# Altium schematic sheet fpga.SchDoc: Copper Suicide - FPGA
size Letter; CheckedBy: E. Chiu; CompanyName: Signal Laboratories, Inc.; DrawnBy: J. Brinton; Engineer: J. Brinton; Address1: 3479 Edison Way; Address2: Menlo Park CA 94025; Address3: +1 (877) 778-8435; Address4: siglabs.com; Revision: 1; SheetNumber: 4; SheetTotal: 44
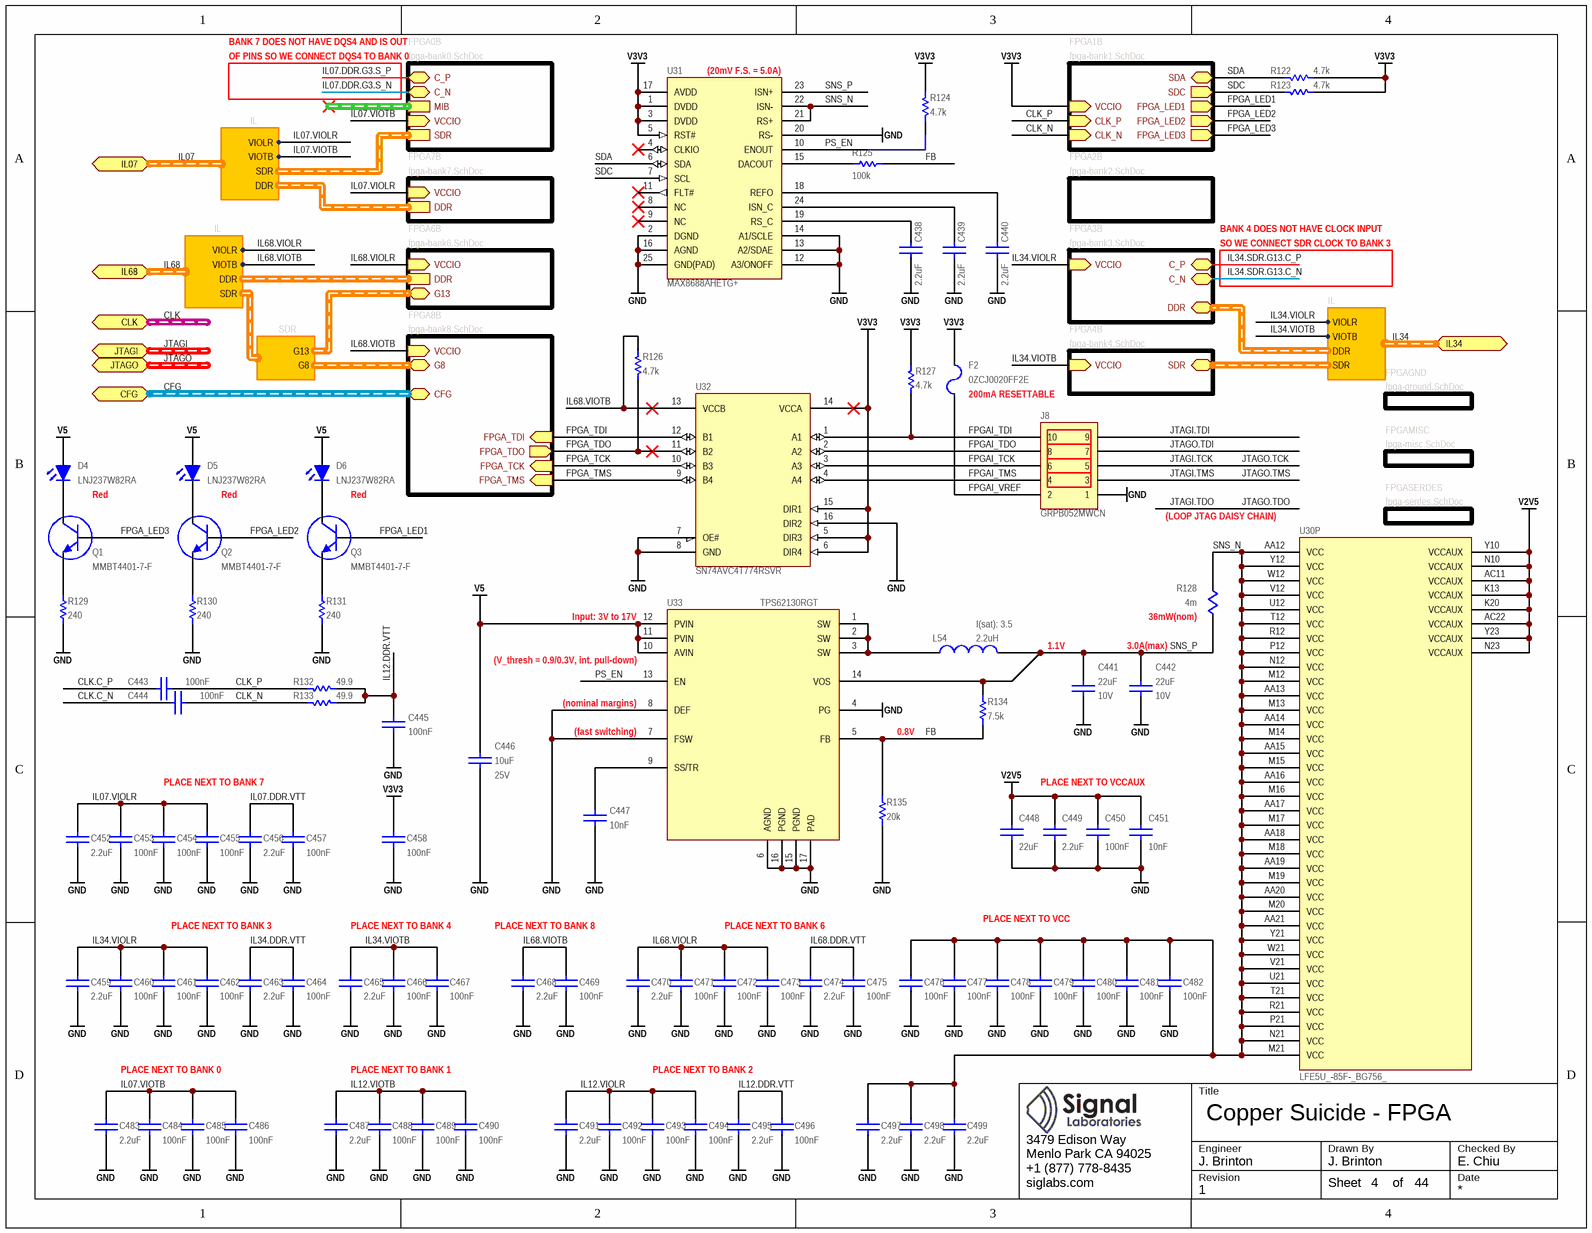
[diagram p0: fpga.SchDoc]

## Parts
C438  value 2.2uF  [CAPC160X80X90L20N]  (hidden comment: C1608X7R1A225M080)
C439  value 2.2uF  [CAPC160X80X90L20N]  (hidden comment: C1608X7R1A225M080)
C440  value 2.2uF  [CAPC160X80X90L20N]  (hidden comment: C1608X7R1A225M080)
C441  value 22uF  Voltage: 10V  [CAPC200X125X145L45N]  (hidden comment: C2012X7S1A226M125)
C442  value 22uF  Voltage: 10V  [CAPC200X125X145L45N]  (hidden comment: C2012X7S1A226M125)
C443  value 100nF  [CAPC100X50X55L25N]  (hidden comment: GCM155R71H104KE02)
C444  value 100nF  [CAPC100X50X55L25N]  (hidden comment: GCM155R71H104KE02)
C445  value 100nF  [CAPC100X50X55L25N]  (hidden comment: GCM155R71H104KE02)
C446  value 10uF  Voltage: 25V  [CAPC200X125X145L45N]  (hidden comment: GRM21BC81E106KE51)
C447  value 10nF  [CAPC100X50X55L25N]  (hidden comment: GRM155R71H103KA88)
C448  value 22uF  [CAPC200X125X145L45N]  (hidden comment: C2012X7S1A226M125)
C449  value 2.2uF  [CAPC160X80X90L20N]  (hidden comment: C1608X7R1A225M080)
C450  value 100nF  [CAPC100X50X55L25N]  (hidden comment: GCM155R71H104KE02)
C451  value 10nF  [CAPC100X50X55L25N]  (hidden comment: GRM155R71H103KA88)
C452  value 2.2uF  [CAPC160X80X90L20N]  (hidden comment: C1608X7R1A225M080)
C453  value 100nF  [CAPC100X50X55L25N]  (hidden comment: GCM155R71H104KE02)
C454  value 100nF  [CAPC100X50X55L25N]  (hidden comment: GCM155R71H104KE02)
C455  value 100nF  [CAPC100X50X55L25N]  (hidden comment: GCM155R71H104KE02)
C456  value 2.2uF  [CAPC160X80X90L20N]  (hidden comment: C1608X7R1A225M080)
C457  value 100nF  [CAPC100X50X55L25N]  (hidden comment: GCM155R71H104KE02)
C458  value 100nF  [CAPC100X50X55L25N]  (hidden comment: GCM155R71H104KE02)
C459  value 2.2uF  [CAPC160X80X90L20N]  (hidden comment: C1608X7R1A225M080)
C460  value 100nF  [CAPC100X50X55L25N]  (hidden comment: GCM155R71H104KE02)
C461  value 100nF  [CAPC100X50X55L25N]  (hidden comment: GCM155R71H104KE02)
C462  value 100nF  [CAPC100X50X55L25N]  (hidden comment: GCM155R71H104KE02)
C463  value 2.2uF  [CAPC160X80X90L20N]  (hidden comment: C1608X7R1A225M080)
C464  value 100nF  [CAPC100X50X55L25N]  (hidden comment: GCM155R71H104KE02)
C465  value 2.2uF  [CAPC160X80X90L20N]  (hidden comment: C1608X7R1A225M080)
C466  value 100nF  [CAPC100X50X55L25N]  (hidden comment: GCM155R71H104KE02)
C467  value 100nF  [CAPC100X50X55L25N]  (hidden comment: GCM155R71H104KE02)
C468  value 2.2uF  [CAPC160X80X90L20N]  (hidden comment: C1608X7R1A225M080)
C469  value 100nF  [CAPC100X50X55L25N]  (hidden comment: GCM155R71H104KE02)
C470  value 2.2uF  [CAPC160X80X90L20N]  (hidden comment: C1608X7R1A225M080)
C471  value 100nF  [CAPC100X50X55L25N]  (hidden comment: GCM155R71H104KE02)
C472  value 100nF  [CAPC100X50X55L25N]  (hidden comment: GCM155R71H104KE02)
C473  value 100nF  [CAPC100X50X55L25N]  (hidden comment: GCM155R71H104KE02)
C474  value 2.2uF  [CAPC160X80X90L20N]  (hidden comment: C1608X7R1A225M080)
C475  value 100nF  [CAPC100X50X55L25N]  (hidden comment: GCM155R71H104KE02)
C476  value 100nF  [CAPC100X50X55L25N]  (hidden comment: GCM155R71H104KE02)
C477  value 100nF  [CAPC100X50X55L25N]  (hidden comment: GCM155R71H104KE02)
C478  value 100nF  [CAPC100X50X55L25N]  (hidden comment: GCM155R71H104KE02)
C479  value 100nF  [CAPC100X50X55L25N]  (hidden comment: GCM155R71H104KE02)
C480  value 100nF  [CAPC100X50X55L25N]  (hidden comment: GCM155R71H104KE02)
C481  value 100nF  [CAPC100X50X55L25N]  (hidden comment: GCM155R71H104KE02)
C482  value 100nF  [CAPC100X50X55L25N]  (hidden comment: GCM155R71H104KE02)
C483  value 2.2uF  [CAPC160X80X90L20N]  (hidden comment: C1608X7R1A225M080)
C484  value 100nF  [CAPC100X50X55L25N]  (hidden comment: GCM155R71H104KE02)
C485  value 100nF  [CAPC100X50X55L25N]  (hidden comment: GCM155R71H104KE02)
C486  value 100nF  [CAPC100X50X55L25N]  (hidden comment: GCM155R71H104KE02)
C487  value 2.2uF  [CAPC160X80X90L20N]  (hidden comment: C1608X7R1A225M080)
C488  value 100nF  [CAPC100X50X55L25N]  (hidden comment: GCM155R71H104KE02)
C489  value 100nF  [CAPC100X50X55L25N]  (hidden comment: GCM155R71H104KE02)
C490  value 100nF  [CAPC100X50X55L25N]  (hidden comment: GCM155R71H104KE02)
C491  value 2.2uF  [CAPC160X80X90L20N]  (hidden comment: C1608X7R1A225M080)
C492  value 100nF  [CAPC100X50X55L25N]  (hidden comment: GCM155R71H104KE02)
C493  value 100nF  [CAPC100X50X55L25N]  (hidden comment: GCM155R71H104KE02)
C494  value 100nF  [CAPC100X50X55L25N]  (hidden comment: GCM155R71H104KE02)
C495  value 2.2uF  [CAPC160X80X90L20N]  (hidden comment: C1608X7R1A225M080)
C496  value 100nF  [CAPC100X50X55L25N]  (hidden comment: GCM155R71H104KE02)
C497  value 2.2uF  [CAPC160X80X90L20N]  (hidden comment: C1608X7R1A225M080)
C498  value 2.2uF  [CAPC160X80X90L20N]  (hidden comment: C1608X7R1A225M080)
C499  value 2.2uF  [CAPC160X80X90L20N]  (hidden comment: C1608X7R1A225M080)
D4  LNJ237W82RA  [0603_LED]
D5  LNJ237W82RA  [0603_LED]
D6  LNJ237W82RA  [0603_LED]
F2  0ZCJ0020FF2E  [1206]
J8  GRPB052MWCN  [GRPB052MWCN]
L54  value 2.2uH  I(sat): 3.5  [XFL4020]  (hidden comment: XFL4020-222ME)
Q1  MMBT4401-7-F  [SOT23]
Q2  MMBT4401-7-F  [SOT23]
Q3  MMBT4401-7-F  [SOT23]
R122  value 4.7k  [RESC1005X40N]  (hidden comment: ERJ-2RKF4701X)
R123  value 4.7k  [RESC1005X40N]  (hidden comment: ERJ-2RKF4701X)
R124  value 4.7k  [RESC1005X40N]  (hidden comment: ERJ-2RKF4701X)
R125  value 100k  [RESC1005X40N]  (hidden comment: ERJ-2RKF1003X)
R126  value 4.7k  [RESC1005X40N]  (hidden comment: ERJ-2RKF4701X)
R127  value 4.7k  [RESC1005X40N]  (hidden comment: ERJ-2RKF4701X)
R128  value 4m  [RESC3216X80L110N]  (hidden comment: CSR1206-0R004F1)
R129  value 240  [RESC1005X40N]  (hidden comment: ERJ-2RKF2400X)
R130  value 240  [RESC1005X40N]  (hidden comment: ERJ-2RKF2400X)
R131  value 240  [RESC1005X40N]  (hidden comment: ERJ-2RKF2400X)
R132  value 49.9  [RESC1005X40N]  (hidden comment: ERJ-2RKF49R9X)
R133  value 49.9  [RESC1005X40N]  (hidden comment: ERJ-2RKF49R9X)
R134  value 7.5k  [RESC2012X70N]  (hidden comment: ERA-6AEB752V)
R135  value 20k  [RESC2012X70N]  (hidden comment: ERA-6AEB203V)
U30  LFE5U_-85F-_BG756_  [caBGA756]  (part P of 19)
U31  MAX8688AHETG+  [QFN25P50_400X400X80L40X24T260N]
U32  SN74AVC4T774RSVR  [RSV]
U33  TPS62130RGT  [S-PQFP-8N_NOVIA]

## Sub-sheets
FPGA0B = fpga-bank0.SchDoc: MIB (harness MIB), SDR (harness SDR), VCCIO (in), C_N, C_P
FPGA1B = fpga-bank1.SchDoc: VCCIO (in), FPGA_LED1 (out), CLK_P (in), CLK_N (in), SDC (out), SDA (bidir), FPGA_LED2 (out), FPGA_LED3 (out)
FPGA2B = fpga-bank2.SchDoc: no entries
FPGA3B = fpga-bank3.SchDoc: DDR (harness DDR), VCCIO (in), C_P (bidir), C_N (bidir)
FPGA4B = fpga-bank4.SchDoc: SDR (harness SDR), VCCIO (in)
FPGA6B = fpga-bank6.SchDoc: DDR (harness DDR), G13 (harness GPIO13), VCCIO (in)
FPGA7B = fpga-bank7.SchDoc: DDR (harness DDR), VCCIO (in)
FPGA8B = fpga-bank8.SchDoc: G8 (harness GPIO8), CFG (harness CFG), FPGA_TDO (out), FPGA_TDI (in), FPGA_TMS (in), FPGA_TCK (in), VCCIO (in)
FPGAGND = fpga-ground.SchDoc: no entries
FPGAMISC = fpga-misc.SchDoc: no entries
FPGASERDES = fpga-serdes.SchDoc: no entries

## Ports
CFG (harness CFG), CLK (harness CLK-LVPECL33), IL07 (harness IL), IL34 (harness IL), IL68 (harness IL), JTAGI (harness JTAG-3V3), JTAGO (harness JTAG-3V3)

## Harnesses
SDR: G13, G8
IL: DDR, SDR, VIOLR, VIOTB

## Nets
GND: C438.1 C439.1 C440.1 C441.1 C442.1 C445.1 C446.1 C447.2 C448.1 C449.1 C450.1 C451.2 C452.1 C453.1 C454.1 C455.1 C456.1 C457.1 C458.1 C459.1 C460.1 C461.1 C462.1 C463.1 C464.1 C465.1 C466.1 C467.1 C468.1 C469.1 C470.1 C471.1 C472.1 C473.1 C474.1 C475.1 C476.1 C477.1 C478.1 C479.1 C480.1 C481.1 C482.1 C483.1 C484.1 C485.1 C486.1 C487.1 C488.1 C489.1 C490.1 C491.1 C492.1 C493.1 C494.1 C495.1 C496.1 C497.1 C498.1 C499.1 J8.1 R129.2 R130.2 R131.2 R135.1 U31.2(DGND) U31.12(A3/ONOFF) U31.13(A2/SDAE) U31.14(A1/SCLE) U31.16(AGND) U31.20(RS-) U31.25(GND(PAD)) U32.7(OE#) U32.8(GND) U32.16(DIR2) U33.4(PG) U33.6(AGND) U33.7(FSW) U33.8(DEF) U33.15(PGND) U33.16(PGND) U33.17(PAD)
V2V5: C448.2 C449.2 C450.2 C451.1 U30.AC11(VCCAUX) U30.AC22(VCCAUX) U30.K13(VCCAUX) U30.K20(VCCAUX) U30.N10(VCCAUX) U30.N23(VCCAUX) U30.Y10(VCCAUX) U30.Y23(VCCAUX)
V3V3: C458.2 F2.1 R122.1 R123.1 R124.2 R127.2 U31.1(DVDD) U31.3(DVDD) U31.5(RST#) U31.17(AVDD) U32.5(DIR3) U32.6(DIR4) U32.14(VCCA) U32.15(DIR1) ; sheet FPGA1B/VCCIO
V5: C446.2 D4.1(A) D5.1(A) D6.1(A) U33.10(AVIN) U33.11(PVIN) U33.12(PVIN)
CLK.C_N: C444.2
CLK.C_P: C443.2
CLK_N: C444.1 R133.2 ; sheet FPGA1B/CLK_N
CLK_P: C443.1 R132.2 ; sheet FPGA1B/CLK_P
FB: R125.2 R134.1 R135.2 U33.5(FB)
FPGA_LED1: Q3.1(B) ; sheet FPGA1B/FPGA_LED1
FPGA_LED2: Q2.1(B) ; sheet FPGA1B/FPGA_LED2
FPGA_LED3: Q1.1(B) ; sheet FPGA1B/FPGA_LED3
FPGA_TCK: U32.10(B3) ; sheet FPGA8B/FPGA_TCK
FPGA_TDI: U32.12(B1) ; sheet FPGA8B/FPGA_TDI
FPGA_TDO: R126.1 U32.11(B2) ; sheet FPGA8B/FPGA_TDO
FPGA_TMS: U32.9(B4) ; sheet FPGA8B/FPGA_TMS
FPGAI_TCK: J8.6 U32.3(A3)
FPGAI_TDI: J8.10 R127.1 U32.1(A1)
FPGAI_TDO: J8.8 U32.2(A2)
FPGAI_TMS: J8.4 U32.4(A4)
FPGAI_VREF: F2.2 J8.2
IL07.DDR.G3.S_N: sheet FPGA0B/C_N
IL07.DDR.G3.S_P: sheet FPGA0B/C_P
IL07.DDR.VTT: C456.2 C457.2
IL07.VIOLR: C452.2 C453.2 C454.2 C455.2 ; sheet FPGA7B/VCCIO, port IL07.VIOLR
IL07.VIOTB: C483.2 C484.2 C485.2 C486.2 ; sheet FPGA0B/VCCIO, port IL07.VIOTB
IL12.DDR.VTT: C445.2 C495.2 C496.2 R132.1 R133.1
IL12.VIOLR: C491.2 C492.2 C493.2 C494.2
IL12.VIOTB: C487.2 C488.2 C489.2 C490.2
IL34.DDR.VTT: C463.2 C464.2
IL34.SDR.G13.C_N: sheet FPGA3B/C_N
IL34.SDR.G13.C_P: sheet FPGA3B/C_P
IL34.VIOLR: C459.2 C460.2 C461.2 C462.2 ; sheet FPGA3B/VCCIO, port IL34.VIOLR
IL34.VIOTB: C465.2 C466.2 C467.2 ; sheet FPGA4B/VCCIO, port IL34.VIOTB
IL68.DDR.VTT: C474.2 C475.2
IL68.VIOLR: C470.2 C471.2 C472.2 C473.2 ; sheet FPGA6B/VCCIO, port IL68.VIOLR
IL68.VIOTB: C468.2 C469.2 R126.2 U32.13(VCCB) ; sheet FPGA8B/VCCIO, port IL68.VIOTB
JTAGI.TCK: J8.5  [also labelled JTAGO.TCK]
JTAGI.TDI: J8.9
JTAGI.TMS: J8.3  [also labelled JTAGO.TMS]
JTAGO.TDI: J8.7
PS_EN: R124.1 U31.10(ENOUT) U33.13(EN)
SDA: R122.2 U31.6(SDA) ; sheet FPGA1B/SDA
SDC: R123.2 U31.7(SCL) ; sheet FPGA1B/SDC
SNS_N: C476.2 C477.2 C478.2 C479.2 C480.2 C481.2 C482.2 C497.2 C498.2 C499.2 R128.2 U30.AA12(VCC) U30.AA13(VCC) U30.AA14(VCC) U30.AA15(VCC) U30.AA16(VCC) U30.AA17(VCC) U30.AA18(VCC) U30.AA19(VCC) U30.AA20(VCC) U30.AA21(VCC) U30.M12(VCC) U30.M13(VCC) U30.M14(VCC) U30.M15(VCC) U30.M16(VCC) U30.M17(VCC) U30.M18(VCC) U30.M19(VCC) U30.M20(VCC) U30.M21(VCC) U30.N12(VCC) U30.N21(VCC) U30.P12(VCC) U30.P21(VCC) U30.R12(VCC) U30.R21(VCC) U30.T12(VCC) U30.T21(VCC) U30.U12(VCC) U30.U21(VCC) U30.V12(VCC) U30.V21(VCC) U30.W12(VCC) U30.W21(VCC) U30.Y12(VCC) U30.Y21(VCC) U31.21(RS+) U31.22(ISN-)
SNS_P: C441.2 C442.2 L54.2 R128.1 R134.2 U31.23(ISN+) U33.14(VOS)
NetC438_2: C438.2 U31.19(RS_C)
NetC439_2: C439.2 U31.24(ISN_C)
NetC440_2: C440.2 U31.18(REFO)
NetC447_1: C447.1 U33.9(SS/TR)
NetD4_2: D4.2(K) Q1.3(C)
NetD5_2: D5.2(K) Q2.3(C)
NetD6_2: D6.2(K) Q3.3(C)
NetL54_1: L54.1 U33.1(SW) U33.2(SW) U33.3(SW)
NetQ1_2: Q1.2(E) R129.1
NetQ2_2: Q2.2(E) R130.1
NetQ3_2: Q3.2(E) R131.1
NetR125_1: R125.1 U31.15(DACOUT)

Not connected (* = marked no-connect by the designer): U31 4(CLKIO)* 8(NC)* 9(NC)* 11(FLT#)*

## Buses and harness runs
harness CFG = port CFG = sheet FPGA8B/CFG
harness CLK = port CLK
harness IL07 = port IL07
harness IL34 = port IL34
harness IL68 = port IL68
harness JTAGI = port JTAGI
harness JTAGO = port JTAGO

## Notes on the sheet
- BANK 7 DOES NOT HAVE DQS4 AND IS OUT
- OF PINS SO WE CONNECT DQS4 TO BANK 0
- (near U31) (20mV F.S. = 5.0A)
- BANK 4 DOES NOT HAVE CLOCK INPUT
- SO WE CONNECT SDR CLOCK TO BANK 3
- (near F2) 200mA RESETTABLE
- Red
- (near U30) (LOOP JTAG DAISY CHAIN)
- (near U33) Input: 3V to 17V
- (near U33) (V_thresh = 0.9/0.3V, int. pull-down)
- 1.1V
- (near C442) 3.0A(max)
- (near R128) 36mW(nom)
- (near U33) (fast switching)
- (near U33) (nominal margins)
- 0.8V
- PLACE NEXT TO BANK 7
- PLACE NEXT TO VCCAUX
- PLACE NEXT TO BANK 3
- PLACE NEXT TO BANK 4
- PLACE NEXT TO BANK 8
- PLACE NEXT TO BANK 6
- PLACE NEXT TO VCC
- PLACE NEXT TO BANK 0
- PLACE NEXT TO BANK 1
- PLACE NEXT TO BANK 2
- Title
- Engineer
- Revision
- Drawn By
- Checked By
- Date
- Sheet
- of

## Library data of the parts
C438-C440 C449 C452 C456 C459 C463 C465 C468 C470 C474 C483 C487 C491 C495 C497-C499 = CAP: Ceramic Capacitor 2.2uF ±20% 10V X7R 0603; Manufacturer: TDK; Tr: -55:125; Manufacturer P/N: C1608X7R1A225M080; Tolerance: ±20%; Voltage: 10V; Footprint: *; Package: 0603
C441 C442 C448 = CAP: Ceramic Capacitor 22uF ±20% 10V X7S 0805; Manufacturer: TDK; Tr: -55:125; Manufacturer P/N: C2012X7S1A226M125; Tolerance: ±20%; Package: 0805
  C448: Voltage: 10V
C443-C445 C450 C453-C455 C457 C458 C460-C462 C464 C466 C467 C469 C471-C473 C475-C482 C484-C486 C488-C490 C492-C494 C496 = CAP: Ceramic Capacitor 100nF ±10% 50V X7R 0402; Manufacturer: Murata; Tr: -55:125; Manufacturer P/N: GCM155R71H104KE02; Tolerance: ±10%; Voltage: 50V; Footprint: *; Package: 0402
C446 = CAP: Ceramic Capacitor 10uF ±10% 25V X6S 0805; Manufacturer: Murata; Tr: -55:105; Manufacturer P/N: GRM21BC81E106KE51; Tolerance: ±10%; Package: 0805
C447 C451 = CAP: Ceramic Capacitor 10nF ±10% 50V X7R 0402; Manufacturer: Murata; Tr: -55:125; Manufacturer P/N: GRM155R71H103KA88; Tolerance: ±10%; Voltage: 50V; Package: 0402
D4-D6 = LED0603RD: LED, SMT 0603, Color Red, 5mA, 1.85V; Manufacturer: Panasonic; Manufacturer P/N: LNJ237W82RA; Package: 0603 Polarized
F2 = 0ZCJ0020FF2E: PTC Resettable Fuse, 0.2A, 30V, SMD 1206; Manufacturer: Bell Fuse; Manufacturer P/N: 0ZCJ0020FF2E; Package: 1206
J8 = GRPB052VWVN: Male Header, 0.050" Pitch, 2x5 Position, Right Angle; Manufacturer: Sullins; Manufacturer P/N: GRPB052MWCN
L54 = COIL: Wirewound Inductor 2.2uH +/-20% 3.5A SMD; Manufacturer: Coilcraft; Manufacturer P/N: XFL4020-222ME
Q1-Q3 = MMBT4401-7-F: NPN Small Signal Transistor SMD SOT-23; Manufacturer: Diodes, Inc.; Manufacturer P/N: MMBT4401-7-F
R122-R124 R126 R127 = RES: Thick Film Resistor 4.7k ±1% 0.1W 75V 0402; Manufacturer: Panasonic; Tcr: ±100; Tr: -55:155; Voltage: 75; Power: 0.1; Tolerance: ±1%; Manufacturer P/N: ERJ-2RKF4701X; Alternatives: *; Footprint: *; Package: 0402
R125 = RES: Thick Film Resistor 100k ±1% 0.1W 50V 0402; Manufacturer: Panasonic; Tcr: ±100; Tr: -55:155; Voltage: 50; Power: 0.1; Manufacturer P/N: ERJ-2RKF1003X; Tolerance: ±1%; Alternatives: *; Footprint: *; Package: 0402
R128 = CSR1206-0R001F1: Current Sense Resistor 4mOhm +/-1% SMD 1206; Manufacturer: Riedon; Manufacturer P/N: CSR1206-0R004F1; Package: 1206
R129-R131 = RES: Thick Film Resistor 240 ±1% 0.1W 75V 0402; Manufacturer: Panasonic; Tcr: ±100; Tr: -55:155; Voltage: 75; Power: 0.1; Tolerance: ±1%; Manufacturer P/N: ERJ-2RKF2400X; Alternatives: *; Footprint: *; Package: 0402
R132 R133 = RES: Thick Film Resistor 49.9 ±1% 0.1W 50V 0402; Manufacturer: Panasonic; Tcr: ±100; Tr: -55:155; Voltage: 50; Power: 0.1; Tolerance: ±1%; Manufacturer P/N: ERJ-2RKF49R9X; Alternatives: *; Footprint: *; Package: 0402
R134 = RES: Thin Film Resistor 7.5k ±0.1% 0.125W 100V 0805; Manufacturer: Panasonic; Tcr: ±25; Tr: -55:155; Voltage: 100; Power: 0.125; Tolerance: ±0.1%; Manufacturer P/N: ERA-6AEB752V; Alternatives: *; Footprint: *; Package: 0805
R135 = RES: Thin Film Resistor 20k ±0.1% 0.125W 100V 0805; Manufacturer: Panasonic; Tcr: ±25; Tr: -55:155; Voltage: 100; Power: 0.125; Tolerance: ±0.1%; Manufacturer P/N: ERA-6AEB203V; Alternatives: *; Footprint: *; Package: 0805
U30 = LFE5U_-85F-_BG756_: ECP5 FPGA, 85k LUT, 756-caBGA; Manufacturer: Lattice Semiconductor; Manufacturer P/N: LFE5U_-85F-_BG756_
U31 = MAX8688AHETG+: Digital Power-Supply Controller/Monitor; Manufacturer: Maxim Integrated; Manufacturer P/N: MAX8688AHETG+
U32 = SN74AVC4T774RSVR: 4-Bit Dual-Supply Bus Transceiver; Manufacturer: Texas Instruments; Manufacturer P/N: SN74AVC4T774RSVR
U33 = TPS62130RGT: 3-17V 3A Step-Down Converter VQFN; Manufacturer: Texas Instruments; Manufacturer P/N: TPS62130RGT